# Altium schematic sheet PROCESSORv35.SchDoc: AMF CONTROLLER GC12 v3.0
size A4; Date: MAR 2013; DrawnBy: SURAJ K A; Engineer: SURAJ K A; Revision: 310; SheetNumber: 1; SheetTotal: 2; DocumentName: AMFR
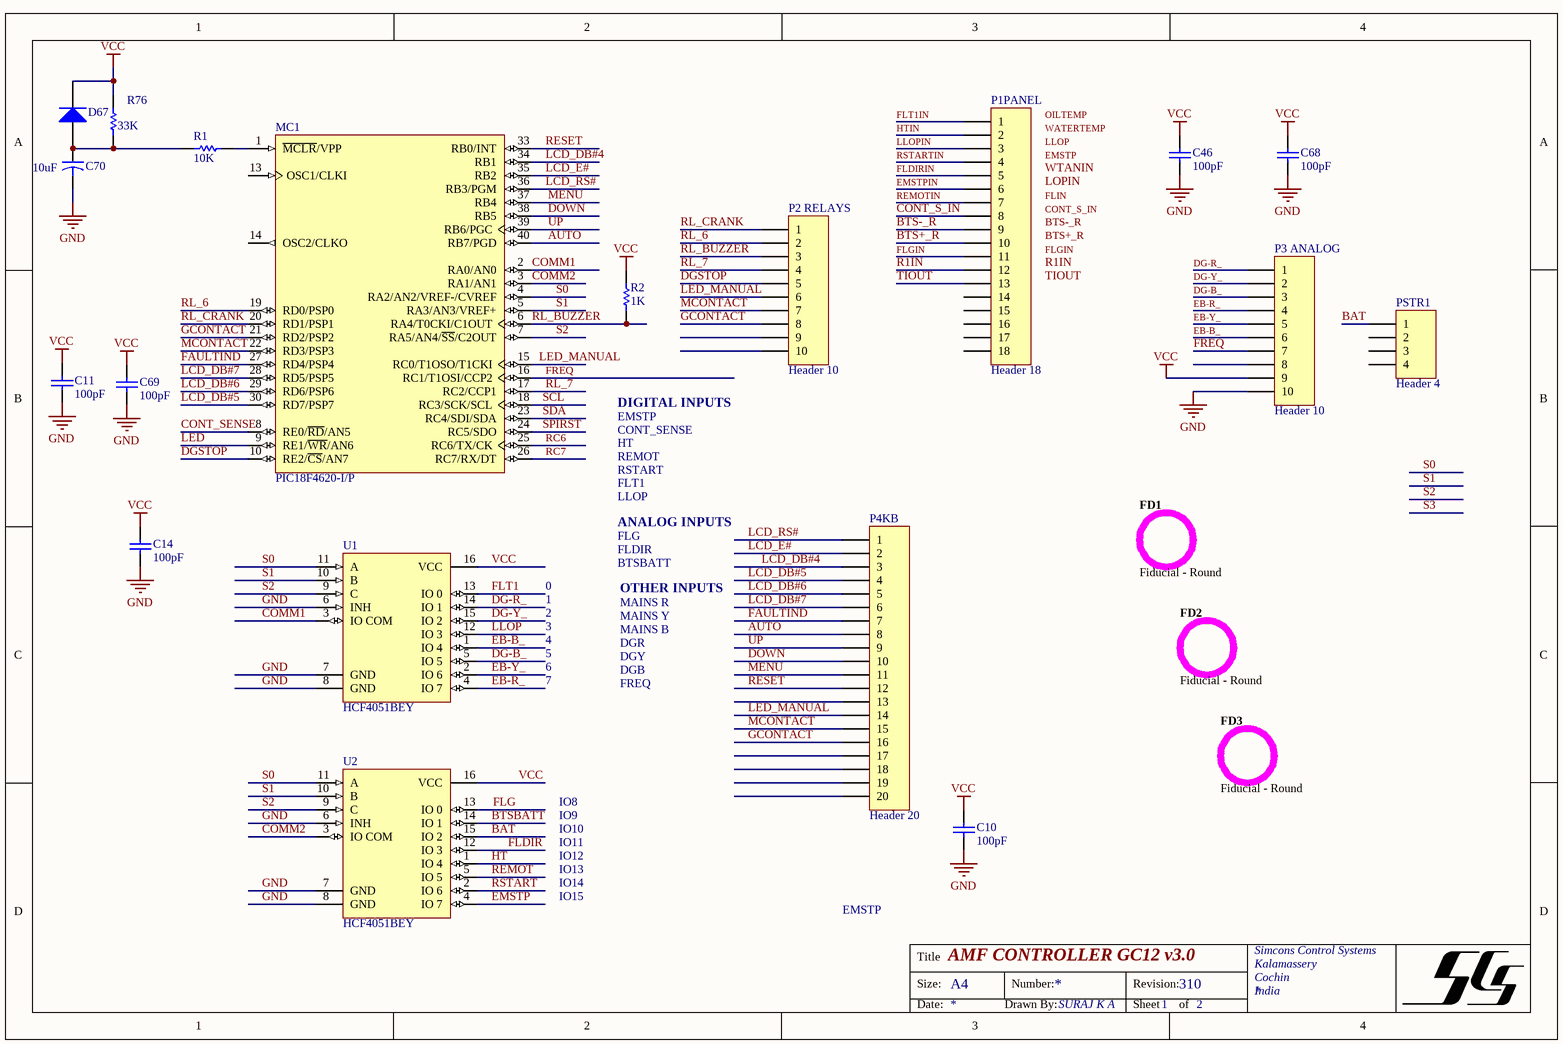
[diagram p0: PROCESSORv35.SchDoc]

## Parts
C10  value 100pF  [C1206]  (hidden comment: .1uF 1206)
C11  value 100pF  [C1206]  (hidden comment: .1uF 1206)
C14  value 100pF  [C1206]  (hidden comment: 1uF 1206)
C46  value 100pF  [C1206]  (hidden comment: .1uF 1206)
C68  value 100pF  [Cap_.1]  (hidden comment: 100uF/25V)
C69  value 100pF  [C1206]  (hidden comment: .1uF 1206)
C70  value 10uF  [C1206]  (hidden comment: 1uF 1206)
D67  1N4148 SMD  [4148SMDW]  (value not drawn)
FD1  Fiducial - Round  [FIDUCIAL 2mm]
FD2  Fiducial - Round  [FIDUCIAL 2mm]
FD3  Fiducial - Round  [FIDUCIAL 2mm]
MC1  PIC18F4620-I/P  [PDIP600-P40]
P1PANEL  Header 18  [HDR1X18_BURGE_F]
P2_RELAYS  Header 10  [HDR1X10_BURGE_F]
P3_ANALOG  Header 10  [HDR1X10_BURGE_F]
P4KB  Header 20  [HDR1X20_BURGE_F]
PSTR1  Header 4  [HDR1X4_BURGE_F]
R1  value 10K  [R1206]  (hidden comment: 4.7K 1206)
R2  value 1K  [R1206]  (hidden comment: 4.7K 1206)
R76  value 33K  [R1206]  (hidden comment: 100K 1206)
U1  HCF4051BEY  [DIP16]
U2  HCF4051BEY  [DIP16]

## Nets
GND: C10.1 C11.1 C14.1 C46.1 C68.2 C69.1 C70.2 MC1.12(VSS) MC1.31(VSS) P3_ANALOG.10 U1.6(INH) U1.7(GND) U1.8(GND) U2.6(INH) U2.7(GND) U2.8(GND)
VCC: C10.2 C11.2 C14.2 C46.2 C68.1 C69.2 D67.2(K) MC1.11(VDD) MC1.32(VDD) P3_ANALOG.9 R2.2 R76.1 U1.16(VCC) U2.16(VCC)
AUTO: MC1.40(RB7/PGD) P4KB.8
BAT: PSTR1.1 U2.15(IO_2)
BTS+_R: P1PANEL.10
BTS-_R: P1PANEL.9
BTSBATT: U2.14(IO_1)
COMM1: MC1.2(RA0/AN0) U1.3(IO_COM)
COMM2: MC1.3(RA1/AN1) U2.3(IO_COM)
CONT_S_IN: P1PANEL.8
CONT_SENSE: MC1.8(RE0/~{RD}/AN5)
DG-B_: P3_ANALOG.3 U1.5(IO_5)
DG-R_: P3_ANALOG.1 U1.14(IO_1)
DG-Y_: P3_ANALOG.2 U1.15(IO_2)
DGSTOP: MC1.10(RE2/~{CS}/AN7) P2_RELAYS.5
DOWN: MC1.38(RB5) P4KB.10
EB-B_: P3_ANALOG.6 U1.1(IO_4)
EB-R_: P3_ANALOG.4 U1.4(IO_7)
EB-Y_: P3_ANALOG.5 U1.2(IO_6)
EMSTP: U2.4(IO_7)
EMSTPIN: P1PANEL.6
FAULTIND: MC1.27(RD4/PSP4) P4KB.7
FLDIR: U2.12(IO_3)
FLDIRIN: P1PANEL.5
FLG: U2.13(IO_0)
FLGIN: P1PANEL.11
FLT1: U1.13(IO_0)
FLT1IN: P1PANEL.1
FREQ: MC1.16(RC1/T1OSI/CCP2) P3_ANALOG.7
GCONTACT: MC1.21(RD2/PSP2) P2_RELAYS.8 P4KB.16
HT: U2.1(IO_4)
HTIN: P1PANEL.2
LCD_DB#4: MC1.34(RB1) P4KB.3
LCD_DB#5: MC1.30(RD7/PSP7) P4KB.4
LCD_DB#6: MC1.29(RD6/PSP6) P4KB.5
LCD_DB#7: MC1.28(RD5/PSP5) P4KB.6
LCD_E#: MC1.35(RB2) P4KB.2
LCD_RS#: MC1.36(RB3/PGM) P4KB.1
LED: MC1.9(RE1/~{WR}/AN6)
LED_MANUAL: MC1.15(RC0/T1OSO/T1CKI) P2_RELAYS.6 P4KB.14
LLOP: U1.12(IO_3)
LLOPIN: P1PANEL.3
MCONTACT: MC1.22(RD3/PSP3) P2_RELAYS.7 P4KB.15
MENU: MC1.37(RB4) P4KB.11
R1IN: P1PANEL.12
RC6: MC1.25(RC6/TX/CK)
RC7: MC1.26(RC7/RX/DT)
REMOT: U2.5(IO_5)
REMOTIN: P1PANEL.7
RESET: MC1.33(RB0/INT) P4KB.12
RL_6: MC1.19(RD0/PSP0) P2_RELAYS.2
RL_7: MC1.17(RC2/CCP1) P2_RELAYS.4
RL_BUZZER: MC1.6(RA4/T0CKI/C1OUT) P2_RELAYS.3 R2.1
RL_CRANK: MC1.20(RD1/PSP1) P2_RELAYS.1
RSTART: U2.2(IO_6)
RSTARTIN: P1PANEL.4
S0: MC1.4(RA2/AN2/VREF-/CVREF) U1.11(A) U2.11(A)
S1: MC1.5(RA3/AN3/VREF+) U1.10(B) U2.10(B)
S2: MC1.7(RA5/AN4/~{SS}/C2OUT) U1.9(C) U2.9(C)
SCL: MC1.18(RC3/SCK/SCL)
SDA: MC1.23(RC4/SDI/SDA)
SPIRST: MC1.24(RC5/SDO)
TIOUT: P1PANEL.13
UP: MC1.39(RB6/PGC) P4KB.9
NetC70_1: C70.1 D67.1(A) R1.2 R76.2
NetMC1_1: MC1.1(~{MCLR}/VPP) R1.1

Not connected (* = marked no-connect by the designer): MC1 13(OSC1/CLKI) 14(OSC2/CLKO); P1PANEL 14 15 16 17 18; P2_RELAYS 9 10; P3_ANALOG 8; P4KB 13 17 18 19 20; PSTR1 2 3 4

## Notes on the sheet
- DIGITAL INPUTS
- EMSTP
- CONT_SENSE
- HT
- REMOT
- RSTART
- FLT1
- LLOP
- ANALOG INPUTS
- 0
- FLG
- FLDIR
- BTSBATT
- OTHER INPUTS
- 1
- 2
- 3
- 4
- 5
- MAINS R
- MAINS Y
- MAINS B
- DGR
- DGY
- 6
- 7
- DGB
- FREQ
- IO8
- IO9
- IO10
- IO11
- IO12
- IO13
- IO14
- IO15
- Labels drawn without touching a wire or pin: BTS+_R, BTS-_R, CONT_S_IN, EMSTP, FLGIN, FLIN, LLOP, LOPIN, OILTEMP, R1IN, TIOUT, WATERTEMP, WTANIN
- Title
- Size:
- A4
- Number:
- Revision:
- Simcons Control Systems
- Kalamassery
- Cochin
- India
- Date:
- Drawn By:
- SURAJ K A
- Sheet
- of

## Library data of the parts
C10 C11 C14 C46 C68 C69 = Cap: Capacitor; Published: 8-Jun-2000; LatestRevisionDate: 17-Jul-2002; LatestRevisionNote: Re-released for DXP Platform.; PackageReference: RAD-0.3; Publisher: Altium Limited; PackageDescription: Radial Cap, Thru-Hole; 2 Leads; 0.3 in Pin Spacing
C70 = Cap2: Capacitor; Published: 23-Sep-2002; PackageReference: CAPR5-4X5; Publisher: Altium Limited; PackageDescription: Capacitor; 2 Leads
D67 = Diode 1N4001: 1 Amp General Purpose Rectifier; Published: 8-Jun-2000; LatestRevisionDate: 17-Jul-2002; LatestRevisionNote: Re-released for DXP Platform.; DatasheetVersion: 1998; PackageVersion: Aug-1999; PackageReference: DO-41; Publisher: Altium Limited; PackageDescription: Diode, Axial; Body 5.2 x 2.7 mm (LxDia. max), Lead Dia. 0.86 mm (max); Code_JEDEC: DO-204-AL; ComponentLink1Description: Manufacturer Link; ComponentLink1URL: http://www.fairchildsemi.com/; ComponentLink2Description: Datasheet; ComponentLink2URL: http://www.fairchildsemi.com/ds/1N%2F1N4001.pdf
FD1-FD3 = FIDUCIAL ROUND: Fiducial - Round 1.5mm Top-Bottom; Status: Unreleased; Category: Graphic-PCB
MC1 = PIC16F877A-I/P: Enhanced FLASH Microcontroller, 8K (x14-Bit words) FLASH, 368 Bytes RAM, 40-Pin PDIP, Standard VDD Range, Industrial Temperature; ComponentAvailability: Unknown. Contact manufacturer to determine status.; Published: 11-Oct-2004; LatestRevisionDate: 29-Jan-2009; LatestRevisionNote: Sch. layout revised. 3D Model Removed.; DatasheetVersion: revB, Oct-2003; PackageVersion: revBB, Aug-2009; PackageReference: PDIP600-P40; Publisher: Altium Limited; PackageDescription: 40-Lead Plastic Dual In-Line (P) - 600 mil Body [PDIP]; Supplier 1: Digi-Key; Supplier Part Number 1: PIC16F877A-I/P-ND; Supplier 2: Farnell; Supplier Part Number 2: 1523966; Supplier 3: Farnell; Supplier Part Number 3: 9761446; ComponentLink1Description: Datasheet; ComponentLink1URL: http://ww1.microchip.com/downloads/en/DeviceDoc/39582b.pdf; ComponentLink2Description: Packaging Specification; ComponentLink2URL: http://www.microchip.com/stellent/groups/techpub_sg/documents/packagingspec/en012702.pdf; ComponentLink3Description: Microchip.com Home; ComponentLink3URL: http://www.microchip.com/
P1PANEL = Header 18: Header, 18-Pin; LatestRevisionDate: 17-Jul-2002; LatestRevisionNote: Re-released for DXP Platform.; Publisher: Altium Limited
P2_RELAYS P3_ANALOG = Header 10: Header, 10-Pin; LatestRevisionDate: 17-Jul-2002; LatestRevisionNote: Re-released for DXP Platform.; Publisher: Altium Limited
P4KB = Header 20: Header, 20-Pin; LatestRevisionDate: 17-Jul-2002; LatestRevisionNote: Re-released for DXP Platform.; Publisher: Altium Limited
PSTR1 = Header 4: Header, 4-Pin; LatestRevisionDate: 17-Jul-2002; LatestRevisionNote: Re-released for DXP Platform.; Publisher: Altium Limited
R1 R2 R76 = Res1: Resistor; Published: 8-Jun-2000; LatestRevisionDate: 17-Jul-2002; LatestRevisionNote: Re-released for DXP Platform.; Publisher: Altium Limited; PackageDescription: Axial Device, Thru-Hole; 2 Leads; 0.3 in Pin Spacing
  R1 R76: PackageReference: AXIAL-0.4
  R2: PackageReference: AXIAL-0.3
U1 U2 = HCF4051BEY: Analog Multiplexer/Demultiplexer; Published: 8-Jun-2000; LatestRevisionDate: 06-Jun-2005; LatestRevisionNote: Stylized 3D Model Added.; DatasheetVersion: Jun-1989; PackageVersion: Apr-1996; PackageReference: DIP16; Publisher: Altium Limited; PackageDescription: DIP; 16 Leads; Row Spacing 7.62 mm; Pitch 2.54 mm; ComponentLink1Description: Manufacturer Link; ComponentLink1URL: http://www.st.com/; ComponentLink2Description: Datasheet; ComponentLink2URL: http://www.st.com/stonline/products/literature/ds/2053/hcf4051.pdf